# EasyEDA Pro project OSC-chaosheng.eprj, schematic 触发电路
Create Date: 2025-01-07; Page Name: P1; Project Name: OSC-chaosheng; Schematic Name: 触发电路; Update Date: 2025-01-07; Company: 嘉立创EDA; Page Size: A4; Version: V1.0
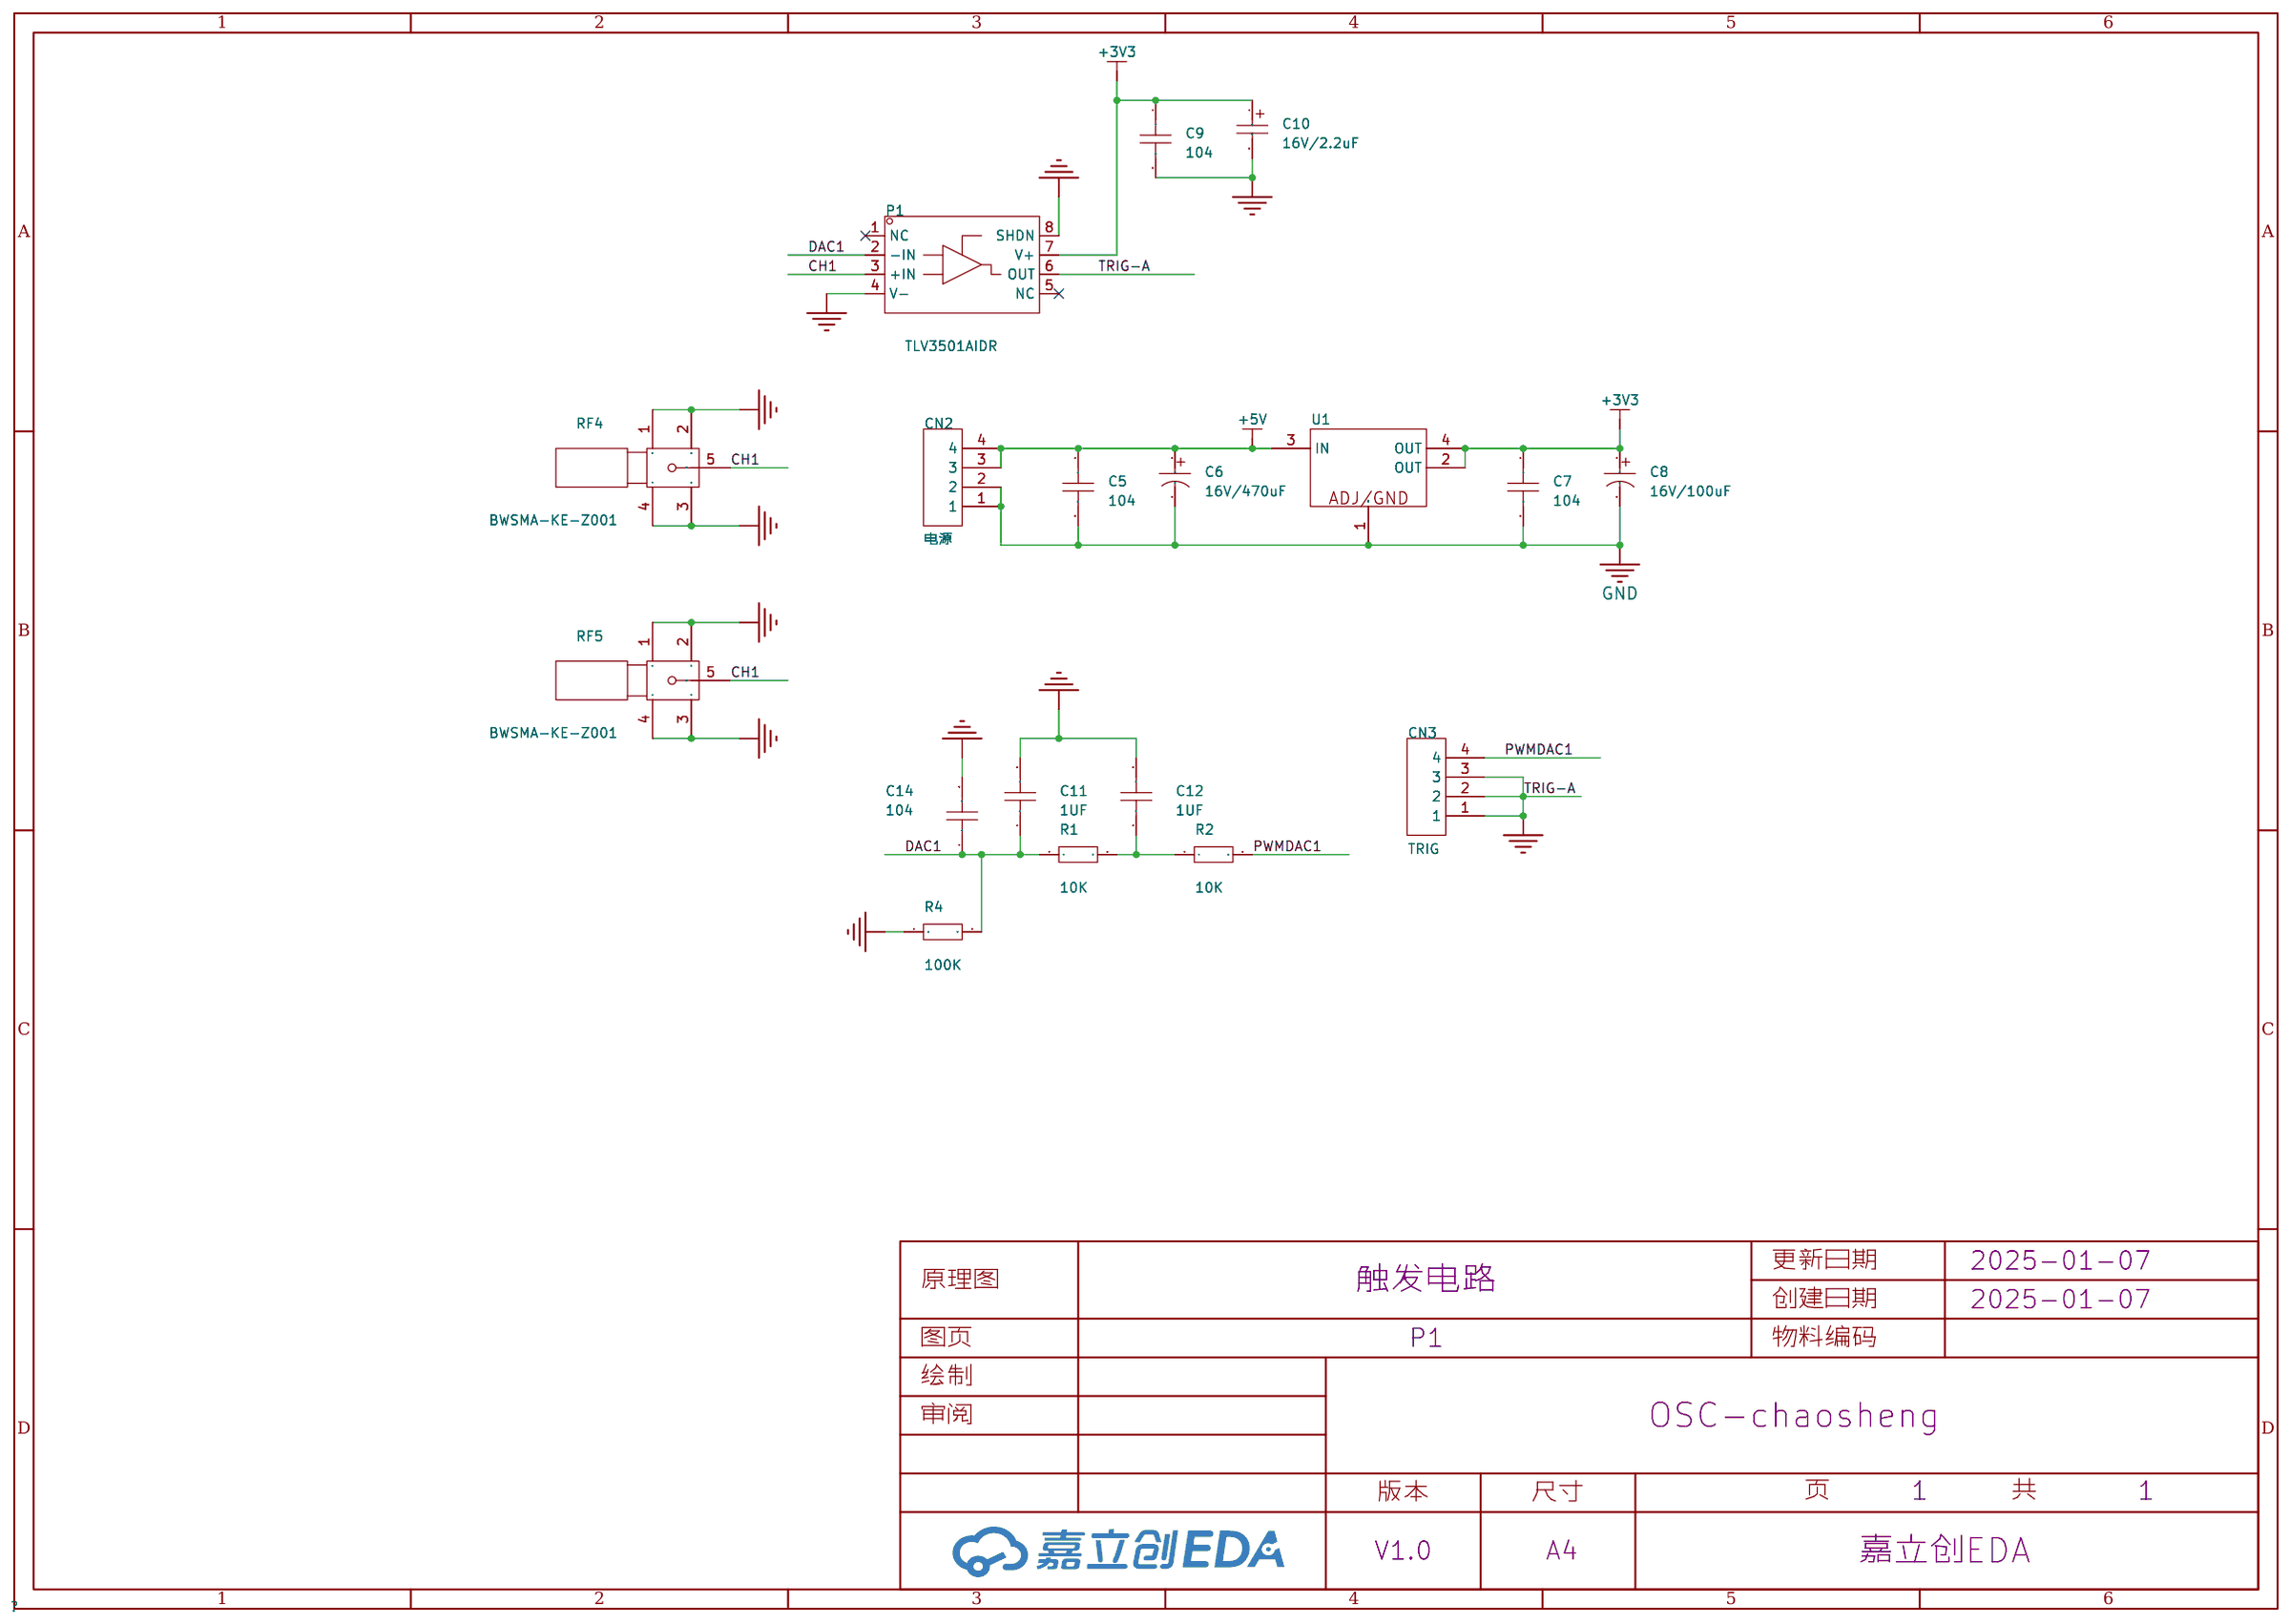
[diagram p8: schematic sheet]

## Parts
C5  104  [CAP-TH_L7.2-W4.0-P5.00-D0.5]
C6  16V/470uF  [CAP-TH_BD8.0-P3.50-D0.6-FD]
C7  104  [CAP-TH_L7.2-W4.0-P5.00-D0.5]
C8  16V/100uF  [CAP-TH_BD6.3-P2.50-D1.0-FD]
C9  104  [CAP-TH_L7.2-W4.0-P5.00-D0.5]
C10  16V/2.2uF  [CASE-A_3216]
C11  1UF  [280*100mil]
C12  1UF  [280*100mil]
C14  104  [CAP-TH_L7.2-W4.0-P5.00-D0.5]
CN2  电源  [CONN-TH_4P-P2.54_A2510S-4P]
CN3  TRIG  [CONN-TH_4P-P2.54_A2510S-4P]
P1  TLV3501AIDR  [SOP-8_L4.9-W3.9-P1.27-LS6.0-BL]
R1  10K  [240*80mil]
R2  10K  [240*80mil]
R4  100K  [240*80mil]
RF4  BWSMA-KE-Z001  [SMA-TH_BWSMA-KE-Z001]
RF5  BWSMA-KE-Z001  [SMA-TH_BWSMA-KE-Z001]
U1  AMS1117-3.3  [SOT-223-3_L6.4-W3.5-P2.30-LS7.0-BR]

## Library data of the parts
C5 C7 C9 C14 = 104电容: 容值:100nF;精度:±5%;额定电压:100V;工作温度:-40~+105;; LCSC Part Name: 100nF ±5% 100V; Supplier Part: C333827; Manufacturer: HEL鸿志; Manufacturer Part: MES104J2A-7-50R0; Supplier Footprint: 径向引线,P=5mm; JLCPCB Part Class: 扩展库; Datasheet: https://atta.szlcsc.com/upload/public/pdf/source/20190802/C333827_0C3A382E0AFB64319515A56455BE3B3E.pdf; Supplier: LCSC; Tolerance: ±5%; Voltage Rated: 100V; Operating Temperature: -40~+105
C6 = 16V/470uF: 脚间距:3.5mm;电容体直径:8mm;精度:±20%;工作温度:-;额定电压:16V;容值:470uF;工作寿命:2000hrs 105℃;电容体长度:12mm;; Rated Voltage: 16V; Supplier: LCSC; Supplier Part: C28067; Supplier Footprint: 径向引线,8x12mm; JLCPCB Part Class: 扩展库; LCSC Part Name: 470uF 16V; Tolerance: ±20%; Datasheet: https://atta.szlcsc.com/upload/public/pdf/source/20151029/1457707512884.pdf; Manufacturer: CX(承兴); Manufacturer Part: KM477M016F12RR0VH2FP0; L: 12mm; Lead Spacing: 3.5mm; Lifetime @ Temp: 2000hrs 105℃; φD: 8mm
C8 = 16V/100uF: 纹波电流:95mA 120Hz;电容体直径:6.3mm;电容体长度:7mm;工作寿命:5000hrs 105℃;等效串联电阻:-;精度:±20%;工作温度:-;额定电压:16V;容值:100uF;脚间距:2.5mm;; Rated Voltage: 16V; Supplier: LCSC; Supplier Part: C88806; Supplier Footprint: 径向引线,6.3x7mm; JLCPCB Part Class: 扩展库; LCSC Part Name: 100uF 16V; Tolerance: ±20%; Datasheet: https://atta.szlcsc.com/upload/public/pdf/source/20161125/1480067897511.pdf; Manufacturer: rubycon(红宝石); Manufacturer Part: 16ML100MEFC6.3X7; L: 7mm; Lead Spacing: 2.5mm; Lifetime @ Temp: 5000hrs 105℃; Ripple Current: 95mA 120Hz; φD: 6.3mm
C10 = TAJA225K016RNJ: 容值:2.2uF;精度:±10%;额定电压:16V;等效串联电阻:6.5Ω@100kHz;; LCSC Part Name: 2.2uF ±10% 16V; Supplier Part: C7180; Manufacturer: Kyocera AVX; Supplier Footprint: CASE-A-3216; JLCPCB Part Class: Extended Part; Datasheet: https://atta.szlcsc.com/upload/public/pdf/source/20160107/1457707748378.pdf; Supplier: LCSC; Tolerance: ±10%; Rated Voltage: 16V; Equivalent Series Resistance(ESR): 6.5Ω@100kHz; Operating Temperature: -55℃~+125℃
C11 C12 = 插件电容
CN2 CN3 = 2.54mm4芯插座: 参考系列:-;间距:2.54mm;插针结构:1x4P;排数:1;每排PIN数:4;行距:-;安装方式:-;触头材质:黄铜;; LCSC Part Name: MX2.54 2510系列 插座 1*4P 2.54mm 直针米黄; Supplier Part: C140769; Manufacturer: Ckmtw(灿科盟); Manufacturer Part: W-2510S04P-0000; Supplier Footprint: 插件,P=2.54mm; JLCPCB Part Class: 扩展库; Datasheet: https://atta.szlcsc.com/upload/public/pdf/source/20180423/C140769_E5973268EE8E03CF1A982B681C4FAED0.pdf; Supplier: LCSC; Pitch: 2.54mm; Pins Structure: 1x4P; Number of Rows: 1; Number of PINs Per Row: 4; Contact Material: 黄铜
P1 = TLV3501AIDR: 比较器组数:1;电源电压:2.7V ~ 5.5V, ±1.35V ~ 2.75V;各通道供电电流:5mA;输出类型:CMOS, Push-Pull, Rail-to-Rail, TTL;传播延迟:10ns;; Supplier Part: C43484; Manufacturer: TI(德州仪器); Supplier Footprint: SOP-8_150mil; JLCPCB Part Class: 扩展库; Datasheet: https://atta.szlcsc.com/upload/public/pdf/source/20150319/1457707268212.pdf; Supplier: LCSC; Number of Elements: 1; Supply Voltage（Single）: 2.7V ~ 5.5V, ±1.35V ~ 2.75V; Iq per channel (Typ): 5mA; Output Type: CMOS, Push-Pull, Rail-to-Rail, TTL; Propagation Delay (Max): 10ns; Operating Temperature: -40°C ~ 125°C
R1 R2 R4 = 插件电阻
RF4 RF5 = BWSMA-KE-Z001_C496549: 连接器类型:板端;接口类型:内孔;端口数量:1;接口直径:-;接口长度/高度:-;频率-最大值:-;射频系列:SMA;阻抗:50Ω;样式:正脚;触头材质:-;触头镀层:-;工作温度范围:-65℃~+165℃;焊接温度(最大值):-;; LCSC Part Name: 内孔 SMA 正脚; Supplier Part: C496549; Manufacturer: BAT WIRELESS(蝙蝠无线); Supplier Footprint: 插件; Datasheet: https://atta.szlcsc.com/upload/public/pdf/source/20221228/40BF41E56A06003A0210E1785CA66EA6.pdf; Supplier: LCSC; Connector Type: 板端; Interface Type: 内孔; Number of Ports: 1; RF Series: SMA; Impedance: 50Ω; Style: 正脚; Operating Temperature Range: -65℃~+165℃
U1 = AMS1117-3.3: Supplier Part: C2992570; Manufacturer: 国芯佳品; Supplier Footprint: SOT-223; JLCPCB Part Class: Extended Part; Datasheet: https://atta.szlcsc.com/upload/public/pdf/source/20220729/0D21C21EC310E4778671BF6BAE438640.pdf; Supplier: LCSC

## Nets
+3V3: C7.1 C8.1 C9.1 C10.1 P1.7(V+) U1.2(OUT) U1.4(OUT)
+5V: C5.1 C6.1 CN2.3 CN2.4 U1.3(IN)
GND: C5.2 C6.2 C7.2 C8.2 C9.2 C10.2 C11.2 C12.2 C14.2 CN2.1 CN2.2 CN3.1 CN3.3 P1.4(V-) P1.8(SHDN) R4.1 RF4.1 RF4.2 RF4.3 RF4.4 RF5.1 RF5.2 RF5.3 RF5.4 U1.1(ADJ/GND)
CH1: P1.3(+IN) RF4.5 RF5.5
DAC1: C11.1 C14.1 P1.2(-IN) R1.1 R4.2
PWMDAC1: CN3.4 R2.2
TRIG-A: CN3.2 P1.6(OUT)
$1N704: C12.1 R1.2 R2.1

Not connected (* = marked no-connect by the designer): P1 1(NC)* 5(NC)*
